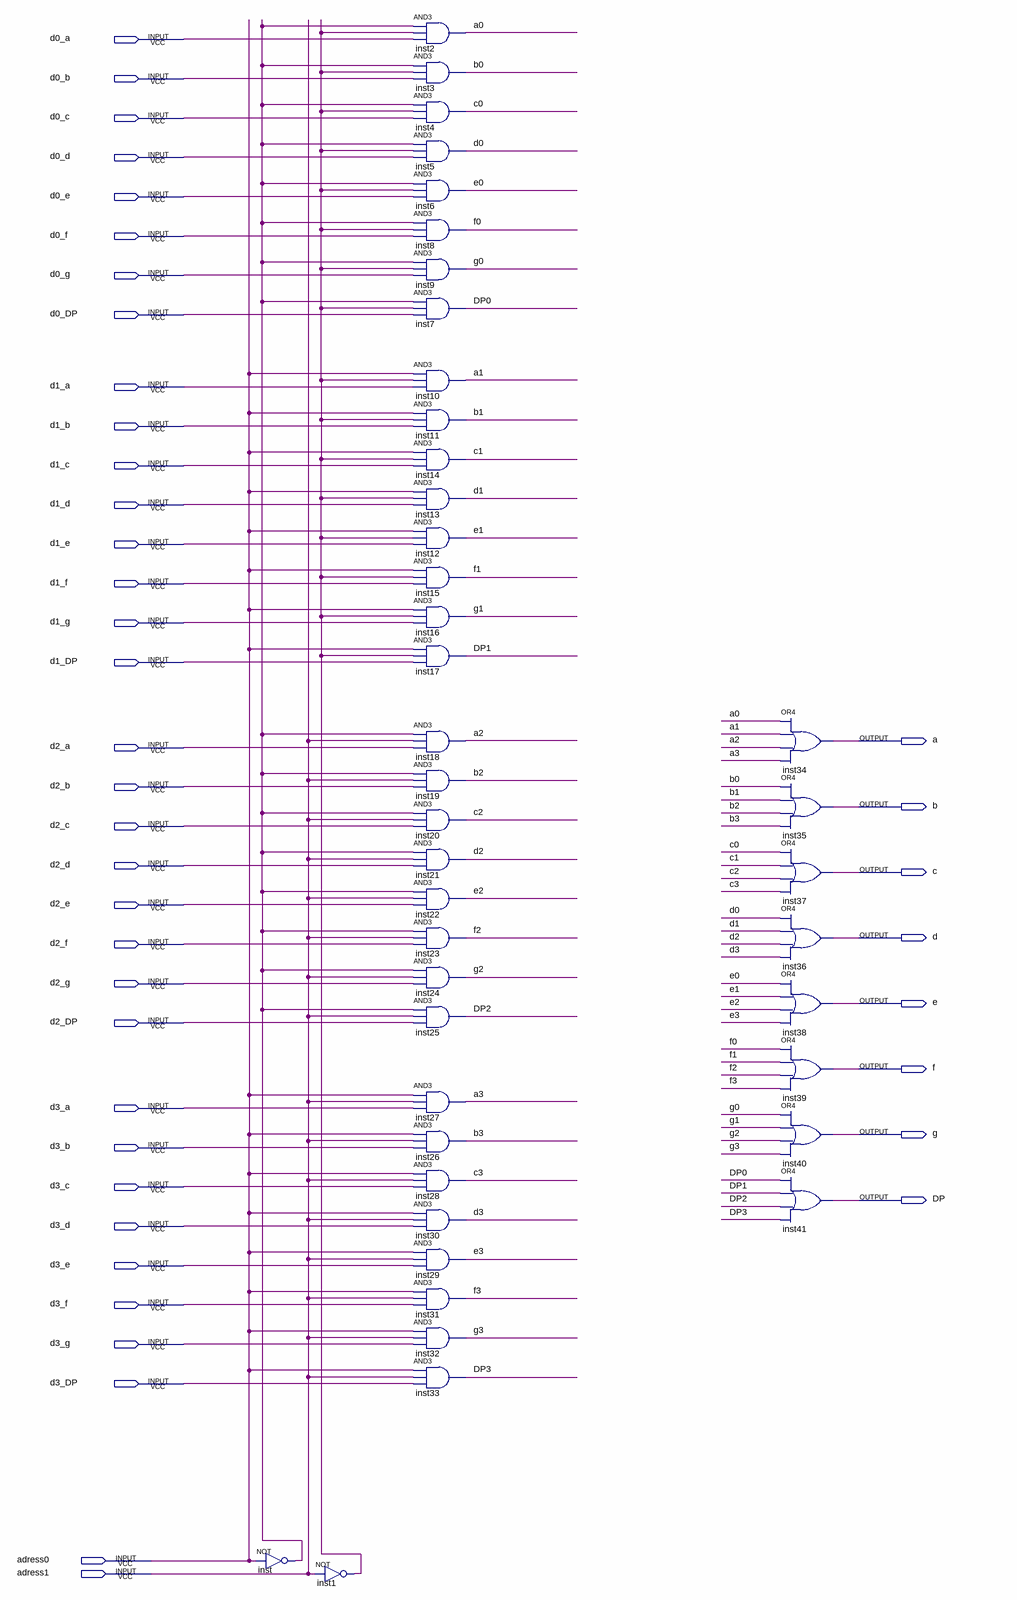
[diagram p0: schematic sheet]
// Quartus schematic Mux32x8bdf.bdf as structural Verilog: 42 symbols, 42 pins
module Mux32x8bdf (
  input  d0_a,
  input  d0_b,
  input  d0_c,
  input  d0_d,
  input  d0_e,
  input  d0_f,
  input  d0_g,
  input  d0_DP,
  input  d1_a,
  input  d1_b,
  input  d1_c,
  input  d1_d,
  input  d1_e,
  input  d1_f,
  input  d1_g,
  input  d1_DP,
  input  d2_a,
  input  d2_b,
  input  d2_c,
  input  d2_d,
  input  d2_e,
  input  d2_f,
  input  d2_g,
  input  d2_DP,
  input  d3_a,
  input  d3_b,
  input  d3_c,
  input  d3_d,
  input  d3_e,
  input  d3_f,
  input  d3_g,
  input  d3_DP,
  input  adress0,
  input  adress1,
  output a,
  output b,
  output c,
  output d,
  output e,
  output f,
  output g,
  output DP
);

  wire a0, a1, a2, a3, b0, b1, b2, b3, c0, c1, c2, c3, d0, d1, d2, d3, DP0, DP1, DP2, DP3, e0, e1, e2, e3,
       f0, f1, f2, f3, g0, g1, g2, g3, inst1_out, inst_out;

  not inst (inst_out, adress0);
  not inst1 (inst1_out, adress1);
  and inst2 (a0, inst_out, inst1_out, d0_a);
  and inst3 (b0, inst_out, inst1_out, d0_b);
  and inst4 (c0, inst_out, inst1_out, d0_c);
  and inst5 (d0, inst_out, inst1_out, d0_d);
  and inst6 (e0, inst_out, inst1_out, d0_e);
  and inst8 (f0, inst_out, inst1_out, d0_f);
  and inst9 (g0, inst_out, inst1_out, d0_g);
  and inst7 (DP0, inst_out, inst1_out, d0_DP);
  and inst10 (a1, adress0, inst1_out, d1_a);
  and inst11 (b1, adress0, inst1_out, d1_b);
  and inst14 (c1, adress0, inst1_out, d1_c);
  and inst13 (d1, adress0, inst1_out, d1_d);
  and inst12 (e1, adress0, inst1_out, d1_e);
  and inst15 (f1, adress0, inst1_out, d1_f);
  and inst16 (g1, adress0, inst1_out, d1_g);
  and inst17 (DP1, adress0, inst1_out, d1_DP);
  and inst18 (a2, inst_out, adress1, d2_a);
  and inst19 (b2, inst_out, adress1, d2_b);
  and inst20 (c2, inst_out, adress1, d2_c);
  and inst21 (d2, inst_out, adress1, d2_d);
  and inst22 (e2, inst_out, adress1, d2_e);
  and inst23 (f2, inst_out, adress1, d2_f);
  and inst24 (g2, inst_out, adress1, d2_g);
  and inst25 (DP2, inst_out, adress1, d2_DP);
  and inst27 (a3, adress0, adress1, d3_a);
  and inst26 (b3, adress0, adress1, d3_b);
  and inst28 (c3, adress0, adress1, d3_c);
  and inst30 (d3, adress0, adress1, d3_d);
  and inst29 (e3, adress0, adress1, d3_e);
  and inst31 (f3, adress0, adress1, d3_f);
  and inst32 (g3, adress0, adress1, d3_g);
  and inst33 (DP3, adress0, adress1, d3_DP);
  or inst34 (a, a0, a1, a2, a3);
  or inst35 (b, b0, b1, b2, b3);
  or inst37 (c, c0, c1, c2, c3);
  or inst36 (d, d0, d1, d2, d3);
  or inst38 (e, e0, e1, e2, e3);
  or inst39 (f, f0, f1, f2, f3);
  or inst40 (g, g0, g1, g2, g3);
  or inst41 (DP, DP0, DP1, DP2, DP3);
endmodule
